# Altium schematic sheet Fan_Config_UART_OptionalHeader.SchDoc
size A3; SheetNumber: 15; SheetTotal: 19
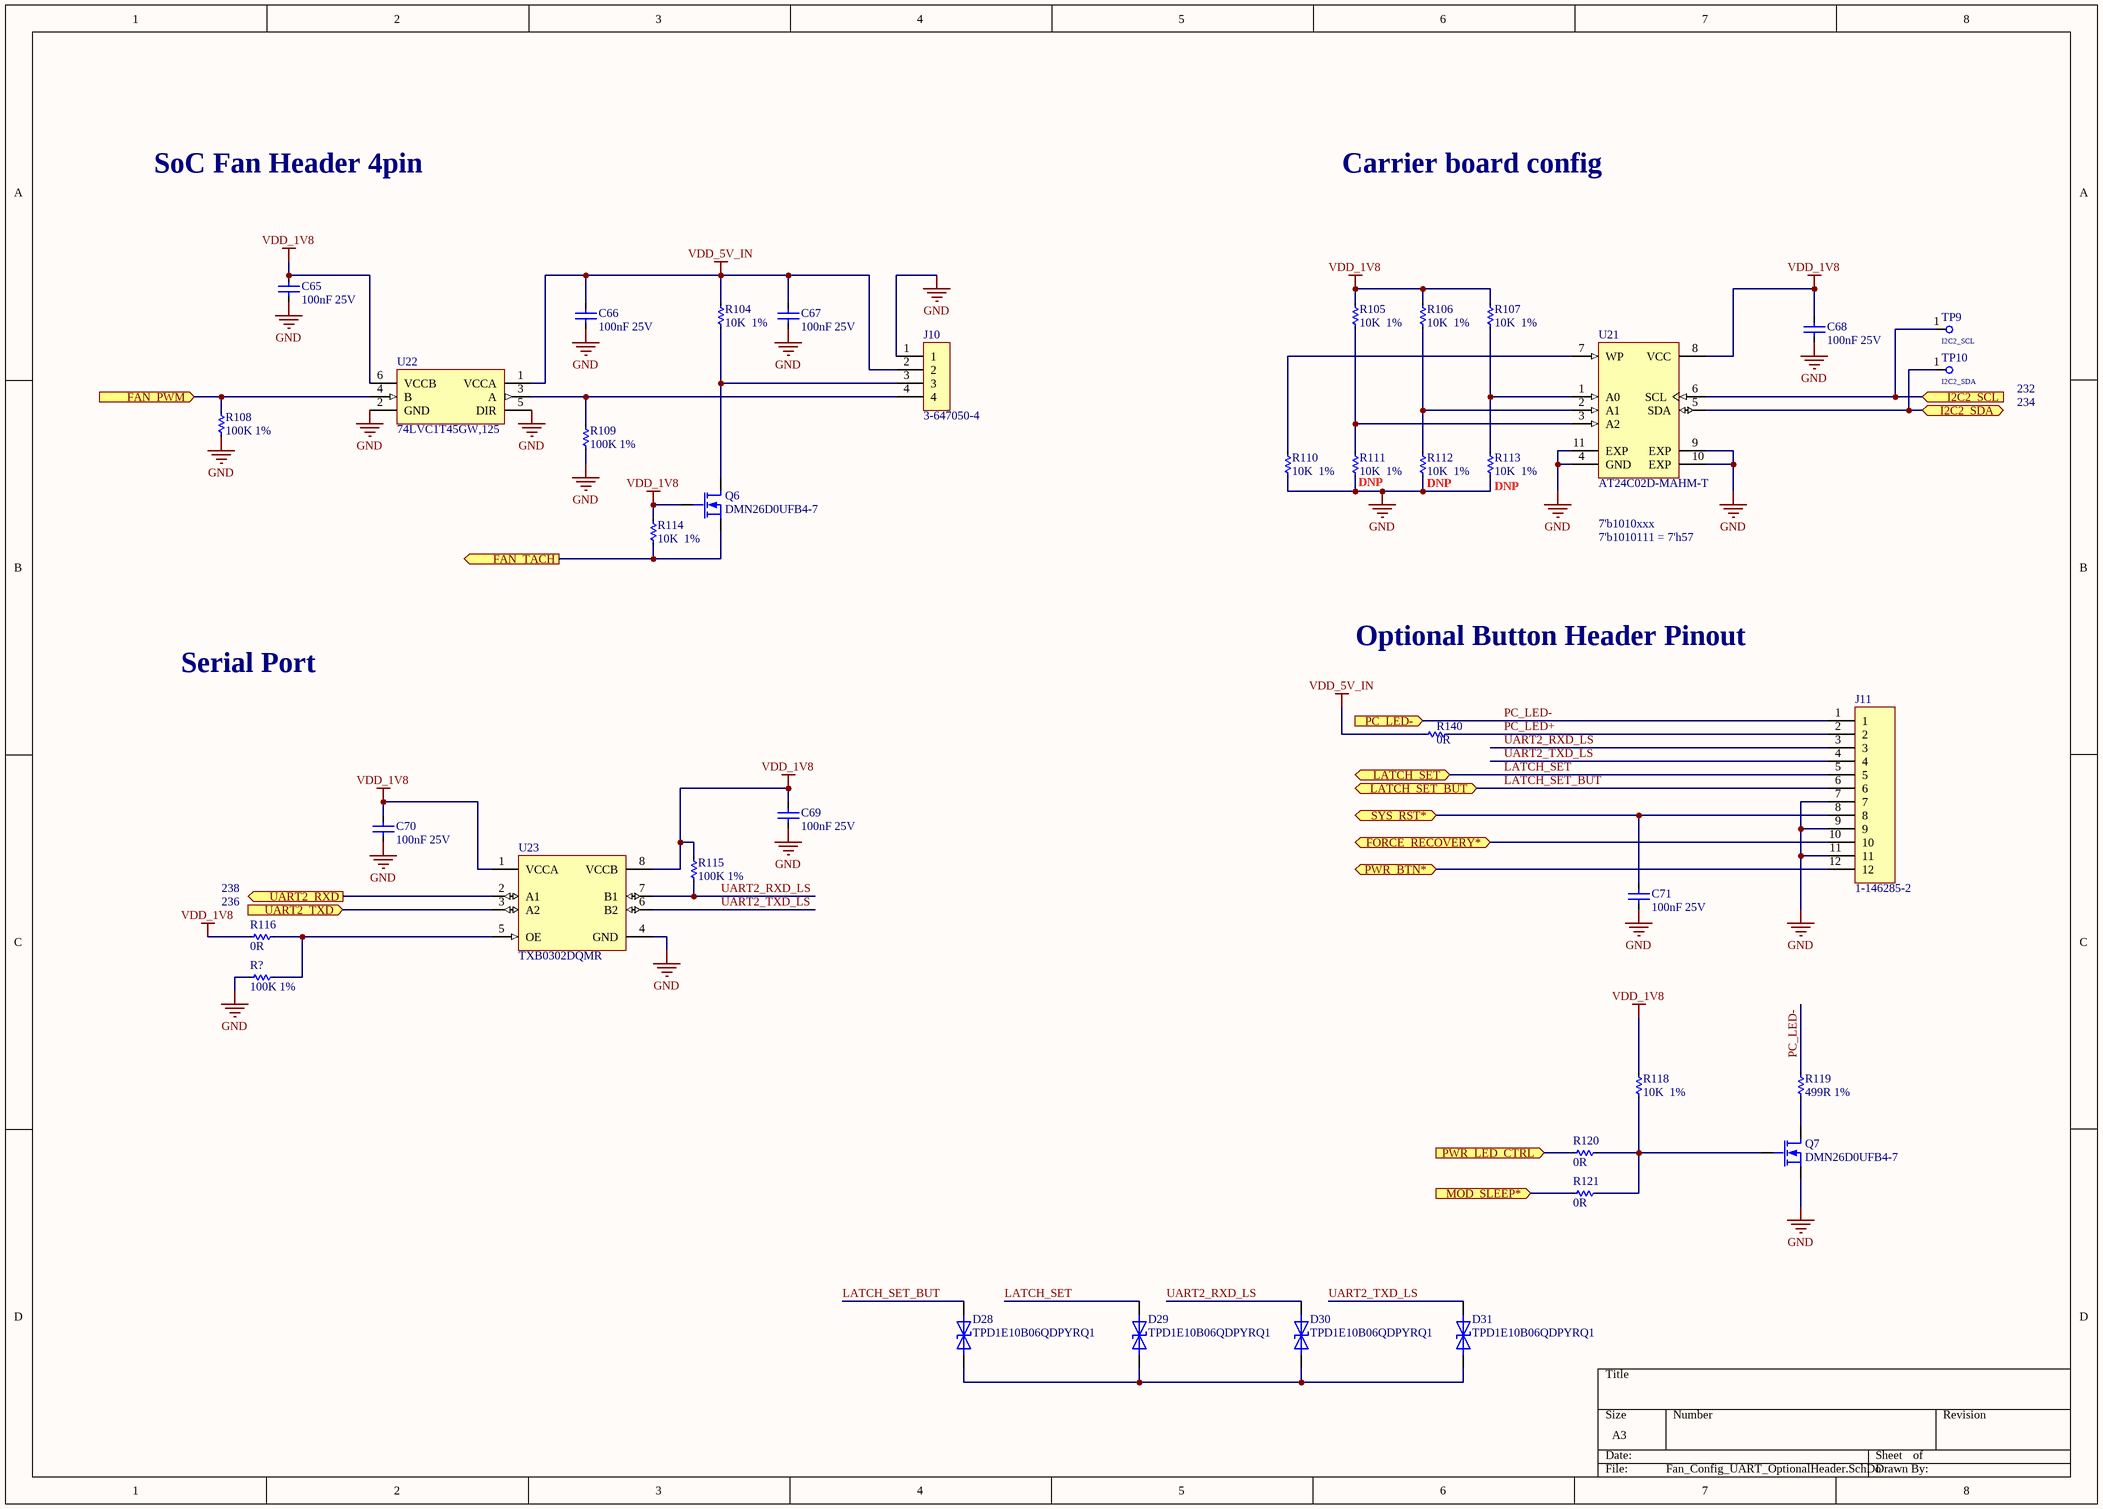
[diagram p0: Fan_Config_UART_OptionalHeader.SchDoc]

## Parts
C65  100nF 25V  [C0402]
C66  100nF 25V  [C0402]
C67  100nF 25V  [C0402]
C68  100nF 25V  [C0402]
C69  100nF 25V  [C0402]
C70  100nF 25V  [C0402]
C71  100nF 25V  [C0402]
D28  TPD1E10B06QDPYRQ1  [2-X1SON (1x.60)]
D29  TPD1E10B06QDPYRQ1  [2-X1SON (1x.60)]
D30  TPD1E10B06QDPYRQ1  [2-X1SON (1x.60)]
D31  TPD1E10B06QDPYRQ1  [2-X1SON (1x.60)]
J10  3-647050-4  [3-647050-4]
J11  1-146285-2
Q6  DMN26D0UFB4-7  [DFN1006-3]
Q7  DMN26D0UFB4-7  [DFN1006-3]
R104  10K  1%  [R0402]
R105  10K  1%  [R0402]
R106  10K  1%  [R0402]
R107  10K  1%  [R0402]
R108  100K 1%  [R0402]
R109  100K 1%  [R0402]
R110  10K  1%  [R0402]
R111  10K  1%  [R0402]
R112  10K  1%  [R0402]
R113  10K  1%  [R0402]
R114  10K  1%  [R0402]
R115  100K 1%  [R0402]
R116  0R  [R0402]
R118  10K  1%  [R0402]
R119  499R 1%  [R0402]
R120  0R  [R0402]
R121  0R  [R0402]
R140  0R  [R0603]
R?  100K 1%  [R0402]
TP9  I2C2_SCL  [TestPoint_Pad_D1.0mm]
TP10  I2C2_SDA  [TestPoint_Pad_D1.0mm]
U21  AT24C02D-MAHM-T  [UDFN (2x3)-8]
U22  74LVC1T45GW,125  [SOT-363]
U23  TXB0302DQMR  [8-X2SON (1.8x1.2)]

## Ports
FAN_PWM (in), FAN_TACH (out), FORCE_RECOVERY* (bidir), I2C2_SCL (in), I2C2_SDA (bidir), LATCH_SET (bidir), LATCH_SET_BUT (bidir), MOD_SLEEP* (in), PC_LED- (in), PWR_BTN* (bidir), PWR_LED_CTRL (in), SYS_RST* (bidir), UART2_RXD (out), UART2_TXD (in)

## Nets
GND: C65.1 C66.1 C67.1 C68.1 C69.1 C70.1 C71.1 J10.1 J11.7 J11.9 J11.11 Q7.2(S) R108.1 R109.1 R110.1 R111.1 R112.1 R113.1 R?.1 U21.4(GND) U21.9(EXP) U21.10(EXP) U21.11(EXP) U22.2(GND) U22.5(DIR) U23.4(GND)
VDD_1V8: C65.2 C68.2 C69.2 C70.2 Q6.1(G) R105.2 R106.2 R107.2 R114.2 R115.2 R116.1 R118.2 U21.8(VCC) U22.6(VCCB) U23.1(VCCA) U23.8(VCCB)
VDD_5V_IN: C66.2 C67.2 J10.2 R104.2 R140.1 U22.1(VCCA)
FAN_PWM: R108.2 U22.4(B) ; port FAN_PWM
FAN_TACH: Q6.2(S) R114.1 ; port FAN_TACH
FORCE_RECOVERY*: J11.10 ; port FORCE_RECOVERY*
I2C2_SCL: TP9.1 U21.6(SCL) ; port I2C2_SCL
I2C2_SDA: TP10.1 U21.5(SDA) ; port I2C2_SDA
LATCH_SET: D29.2 J11.5 ; port LATCH_SET
LATCH_SET_BUT: D28.2 J11.6 ; port LATCH_SET_BUT
MOD_SLEEP*: R121.1 ; port MOD_SLEEP*
PC_LED+: J11.2 R140.2
PC_LED-: J11.1 R119.2 ; port PC_LED-
PWR_BTN*: J11.12 ; port PWR_BTN*
PWR_LED_CTRL: R120.1 ; port PWR_LED_CTRL
SYS_RST*: C71.2 J11.8 ; port SYS_RST*
UART2_RXD: U23.2(A1) ; port UART2_RXD
UART2_RXD_LS: D30.2 J11.3 R115.1 U23.7(B1)
UART2_TXD: U23.3(A2) ; port UART2_TXD
UART2_TXD_LS: D31.2 J11.4 U23.6(B2)
NetD28_1: D28.1 D29.1 D30.1 D31.1
NetJ10_3: J10.3 Q6.3(D) R104.1
NetJ10_4: J10.4 R109.2 U22.3(A)
NetQ7_1: Q7.1(G) R118.1 R120.2 R121.2
NetQ7_3: Q7.3(D) R119.1
NetR105_1: R105.1 R111.2 U21.3(A2)
NetR106_1: R106.1 R112.2 U21.2(A1)
NetR107_1: R107.1 R113.2 U21.1(A0)
NetR110_2: R110.2 U21.7(WP)
NetR116_2: R116.2 R?.2 U23.5(OE)

## Notes on the sheet
- SoC Fan Header 4pin
- Carrier board config
- 232
- 234
- (near R111) DNP
- (near R112) DNP
- (near R113) DNP
- 7'b1010xxx
- 7'b1010111 = 7'h57
- Optional Button Header Pinout
- Serial Port
- (near R116) 238
- (near R116) 236

## Library data of the parts
C65-C71 = TMK105BJ104KV-F: CAP CER 0.1UF 25V X5R 0402 / High Value Multilayer Ceramic Capacitors (High dielectric type); Manufacturer: Taiyo Yuden; Tolerance: 10%; Supplier 1: Digi-Key; Manufacturer Part Number: TMK105BJ104KV-F; RoHS: Yes; Category: Ceramic Capacitors; Stock 1: 11997960; Pricing 1: 1=0.10000, 10=0.03700, 50=0.02000, 100=0.01630, 500=0.01166, 1000=0.00917, 2500=0.00833, 5000=0.00767 (USD); Mount: Surface Mount; Case/Package: 0402; Number of Pins: 2; Case Code (Imperial): 0402; Case Code (Metric): 1005; Weight: 2.3E-05oz; Min Operating Temperature: -55°C; Max Operating Temperature: 85°C; Capacitance: 100nF; Packaging: Tape and Reel; Dielectric: X5R; Voltage Rating (DC): 25V; Voltage Rating: 25V; Package Quantity: 1; Termination: SMD/SMT; Resistor Type: Ceramic; Voltage: 25V; Series: M; Construction: Flat; Length: 1mm; Width: 0.02inch; Height: 0.5mm; Depth: 0.5mm; Thickness: 0.022inch; Reach SVHC Compliant: Yes; Lead Free: Lead Free; Halogen Free: Halogen Free; RoHS Compliant: Yes; Supplier Part Number 1: 587-1456-1-ND
D28-D31 = TPD1E10B06QDPYRQ1: Automotive 12-pF, ±5.5V ±30-kV ESD protection diode in 0402 Package 2-X1SON -40 to 125; Manufacturer: Texas Instruments; Capacitance: 12pF; Number of Channels: 1; Supplier 1: Mouser; Manufacturer Part Number: TPD1E10B06QDPYRQ1; RoHS: Yes; Category: TVS Diodes; Stock 1: 130973; Pricing 1: 1=0.46000, 10=0.34900, 50=0.34900, 100=0.21800, 1000=0.11500, 10000=0.08800 (USD); Case/Package: 0402; Number of Pins: 2; Min Operating Temperature: -40°C; Max Operating Temperature: 125°C; Lead Free: Lead Free; RoHS Compliant: Yes; ComponentLink1URL: http://www.ti.com/lit/ds/symlink/tpd1e10b06-q1.pdf?src-supplier=Digi-Key; ComponentLink1Description: http://www.ti.com/lit/ds/symlink/tpd1e10b06-q1.pdf?src-supplier=Digi-Key; ComponentLink2URL: http://www.ti.com/general/docs/suppproductinfo.tsp?distId=10&amp;gotoUrl=http%3A%2F%2Fwww.ti.com%2Flit%2Fgpn%2Ftpd1e10b06-q1&src-supplier=Digi-Key; ComponentLink2Description: http://www.ti.com/general/docs/suppproductinfo.tsp?distId=10&amp;gotoUrl=http%3A%2F%2Fwww.ti.com%2Flit%2Fgpn%2Ftpd1e10b06-q1&src-supplier=Digi-Key; Supplier Part Number 1: 595-PD1E10B06QDPYRQ1
J10 = 3-647050-4: Header Assembly 4 Position MTA100 F/L HITEMP MTA-100 Series; Manufacturer: TE Connectivity; Supplier 1: Digi-Key; Manufacturer Part Number: 3-647050-4; RoHS: Yes; Category: Uncategorized; Stock 1: 12221; Pricing 1: 1=2.60000, 10=2.26400, 100=2.02290, 500=1.68574, 1000=1.44492, 5000=1.28116 (USD); ComponentLink1URL: https://datasheet.ciiva.com/717/eng-cd-647050-t-647050-c-drw-717307.pdf?src-supplier=Digi-Key; ComponentLink1Description: https://datasheet.ciiva.com/717/eng-cd-647050-t-647050-c-drw-717307.pdf?src-supplier=Digi-Key; ComponentLink2URL: https://datasheet.ciiva.com/30190/8852eng-ds-82056-mta-0608-30190425.pdf?src-supplier=Onlinecomponents.com; ComponentLink2Description: https://datasheet.ciiva.com/30190/8852eng-ds-82056-mta-0608-30190425.pdf?src-supplier=Onlinecomponents.com; Supplier Part Number 1: A122444-ND
J11 = 1-146285-2: Conn Unshrouded Header HDR 12 POS 2.54mm Solder ST Thru-Hole Automotive Carton; Manufacturer: TE Connectivity; Supplier 1: Avnet; Manufacturer Part Number: 1-146285-2; RoHS: No; Category: Connectors; ComponentLink1URL: https://datasheet.ciiva.com/9518/eng-ds-1307819-ampmodu-0811-9518222.pdf?src-supplier=Avnet; ComponentLink1Description: https://datasheet.ciiva.com/9518/eng-ds-1307819-ampmodu-0811-9518222.pdf?src-supplier=Avnet; ComponentLink2URL: https://datasheet.ciiva.com/716/eng-cd-146285-h-716787.pdf?src-supplier=Digi-Key; ComponentLink2Description: https://datasheet.ciiva.com/716/eng-cd-146285-h-716787.pdf?src-supplier=Digi-Key; Supplier Part Number 1: 1-146285-2
Q6 Q7 = DMN26D0UFB4-7: Single N-Channel 20 V 350 mW Silicon Surface Mount Mosfet - DFN-3; Manufacturer: Diodes; Rise Time: 7.9ns; Rds On Max: 3R; Input Capacitance: 14.1pF; Continuous Drain Current (ID): 240mA; Drain to Source Resistance: 1.8R; Power Dissipation: 350mW; Turn-Off Delay Time: 13.4ns; Drain to Source Voltage (Vdss): 20V; Turn-On Delay Time: 3.8ns; Fall Time: 15.2ns; Number of Elements: 1; Gate to Source Voltage (Vgs): 10V; On-State Resistance: 10R; FET Type: 1 N-Channel; Supplier 1: Mouser; Manufacturer Part Number: DMN26D0UFB4-7; RoHS: Yes; Category: MOSFETs; Stock 1: 21043; Pricing 1: 1=0.38000, 10=0.32100, 50=0.32100, 100=0.17000, 1000=0.07700, 10000=0.05000 (USD); Mount: Surface Mount; Case/Package: DFN; Number of Pins: 3; Min Operating Temperature: -55°C; Max Operating Temperature: 150°C; Packaging: Tape and Reel; Package Quantity: 3000; Max Power Dissipation: 350mW; Element Configuration: Single; Number of Channels: 1; Polarity: N-CHANNEL; Series: -; Drain-source On Resistance-Max: 10R; Length: 1.05mm; Width: 0.65mm; Height: 0.35mm; Radiation Hardening: No; Reach SVHC Compliant: Yes; Lead Free: Lead Free; RoHS Compliant: Yes; ComponentLink1URL: https://datasheet.ciiva.com/4443/ds31775-89139-4443083.pdf?src-supplier=Mouser; ComponentLink1Description: https://datasheet.ciiva.com/4443/ds31775-89139-4443083.pdf?src-supplier=Mouser; ComponentLink2URL: https://datasheet.ciiva.com/11176/ds31775-11176556.pdf?src-supplier=Avnet; ComponentLink2Description: https://datasheet.ciiva.com/11176/ds31775-11176556.pdf?src-supplier=Avnet; ComponentLink3URL: https://datasheet.ciiva.com/16434/ds31775-16434037.pdf?src-supplier=Future+Electronics; ComponentLink3Description: https://datasheet.ciiva.com/16434/ds31775-16434037.pdf?src-supplier=Future+Electronics; ComponentLink4URL: https://datasheet.ciiva.com/48532/ds31775-48532486.pdf?src-supplier=Avnet; ComponentLink4Description: https://datasheet.ciiva.com/48532/ds31775-48532486.pdf?src-supplier=Avnet; ComponentLink5URL: https://datasheet.ciiva.com/934/ds31775-934573.pdf?src-supplier=Digi-Key; ComponentLink5Description: https://datasheet.ciiva.com/934/ds31775-934573.pdf?src-supplier=Digi-Key; ComponentLink6URL: https://datasheet.ciiva.com/934/ds31775-934574.pdf?src-supplier=Digi-Key; ComponentLink6Description: https://datasheet.ciiva.com/934/ds31775-934574.pdf?src-supplier=Digi-Key; ComponentLink7URL: https://datasheet.ciiva.com/934/ds31775-934572.pdf?src-supplier=Digi-Key; ComponentLink7Description: https://datasheet.ciiva.com/934/ds31775-934572.pdf?src-supplier=Digi-Key; Supplier Part Number 1: 621-DMN26D0UFB4-7
R104-R107 R110-R114 R118 = RC0402FR-0710KP: Res General Purpose Thick Film 0402 10K Ohm 1% 1/16W ±100ppm/°C Molded SMD Paper T/R; Manufacturer: Yageo; Resistance: 10kR; Max Power Dissipation: 63mW; Temperature Coefficient: 150ppm/°C; Supplier 1: Digi-Key; Manufacturer Part Number: RC0402FR-0710KP; RoHS: Yes; Category: Chip SMD Resistors; Stock 1: 1032587; Pricing 1: 1=0.10000, 10=0.03100, 100=0.01280, 1000=0.00573, 2500=0.00497, 5000=0.00411 (USD); Case/Package: 0402; Case Code (Metric): 1005; Case Code (Imperial): 0402; Min Operating Temperature: -55°C; Max Operating Temperature: 155°C; Packaging: Tape and Reel; Resistor Type: Thick Film; Number of Terminations: 2; Tolerance: 1%; Features: Moisture Resistant; Length: 0.039inch; Width: 0.02inch; Height: 0.016inch; RoHS Compliant: Yes; ComponentLink1URL: http://www.yageo.com/NewPortal/yageodocoutput?fileName=/pdf/R-Chip/PYu-RC_51_RoHS_P_0.pdf&src-supplier=Digi-Key; ComponentLink1Description: http://www.yageo.com/NewPortal/yageodocoutput?fileName=/pdf/R-Chip/PYu-RC_51_RoHS_P_0.pdf&src-supplier=Digi-Key; Supplier Part Number 1: YAG1249CT-ND
R108 R109 R115 R? = RC0402FR-07100KL: RES SMD 100K OHM 1% 1/16W 0402; Manufacturer: Yageo; Power Rating: 63mW; Voltage Rating: 50V; Resistance: 100kR; Temperature Coefficient: 100ppm/°C; Supplier 1: Digi-Key; Manufacturer Part Number: RC0402FR-07100KL; RoHS: Yes; Category: Chip SMD Resistors; Stock 1: 41082272; Pricing 1: 1=0.10000, 10=0.01400, 100=0.00580, 1000=0.00262, 2500=0.00228, 5000=0.00188 (USD); Case/Package: 0402; Case Code (Metric): 1005; Case Code (Imperial): 0402; Min Operating Temperature: -55°C; Max Operating Temperature: 155°C; Tolerance: 1%; Package Quantity: 1; Packaging: Tape and Reel; Resistor Type: Thick Film; Number of Terminations: 2; Termination: SMD/SMT; Max Power Dissipation: 63mW; Working Voltage: 50V; Features: Moisture Resistant; Series: RC; Resistance Tolerance: 1%; Construction: Rectangular; Technology: THICK FILM; Length: 0.039inch; Width: 0.02inch; Height: 0.016inch; Depth: 0.5mm; Reach SVHC Compliant: Yes; Military Standard: Not; Lead Free: Lead Free; RoHS Compliant: Yes; ComponentLink1URL: https://datasheet.ciiva.com/11819/0900766b80c66297-11819452.pdf?src-supplier=RSComponents; ComponentLink1Description: https://datasheet.ciiva.com/11819/0900766b80c66297-11819452.pdf?src-supplier=RSComponents; ComponentLink2URL: https://datasheet.ciiva.com/22747/1018594-22747509.pdf?src-supplier=Element14; ComponentLink2Description: https://datasheet.ciiva.com/22747/1018594-22747509.pdf?src-supplier=Element14; ComponentLink3URL: https://datasheet.ciiva.com/2453/pyu-r-int-thick-7-2453362.pdf?src-supplier=Digi-Key; ComponentLink3Description: https://datasheet.ciiva.com/2453/pyu-r-int-thick-7-2453362.pdf?src-supplier=Digi-Key; ComponentLink4URL: https://datasheet.ciiva.com/2453/pyu-r-int-thick-7-2453363.pdf?src-supplier=Digi-Key; ComponentLink4Description: https://datasheet.ciiva.com/2453/pyu-r-int-thick-7-2453363.pdf?src-supplier=Digi-Key; ComponentLink5URL: https://datasheet.ciiva.com/2453/pyu-r-int-thick-7-2453361.pdf?src-supplier=Digi-Key; ComponentLink5Description: https://datasheet.ciiva.com/2453/pyu-r-int-thick-7-2453361.pdf?src-supplier=Digi-Key; ComponentLink6URL: https://datasheet.ciiva.com/12667/pyu-rc0402-51-rohs-l-6-r-12667930.pdf?src-supplier=Mouser; ComponentLink6Description: https://datasheet.ciiva.com/12667/pyu-rc0402-51-rohs-l-6-r-12667930.pdf?src-supplier=Mouser; ComponentLink7URL: https://datasheet.ciiva.com/15189/getdatasheetpartid-323696-15189334.pdf?src-supplier=Verical; ComponentLink7Description: https://datasheet.ciiva.com/15189/getdatasheetpartid-323696-15189334.pdf?src-supplier=Verical; Supplier Part Number 1: 311-100KLRCT-ND
R116 R120 R121 = RC0402FR-070RL: RC Series 0402 0.063 W 0 Ohm Jumper Surface Mount Thick Film Chip Resistor; Manufacturer: Yageo; Tolerance: 1%; Power Rating: 62.5mW; Voltage Rating: 50V; Temperature Coefficient: 200ppm/°C; Max Power Dissipation: 63mW; Supplier 1: Digi-Key; Manufacturer Part Number: RC0402FR-070RL; RoHS: Yes; Category: Chip SMD Resistors; Stock 1: 8989202; Pricing 1: 1=0.10000, 10=0.01200, 25=0.00840, 50=0.00640, 100=0.00480, 250=0.00364, 500=0.00290, 1000=0.00214, 5000=0.00154 (USD); Mount: Surface Mount; Case/Package: 0402; Case Code (Imperial): 0402; Case Code (Metric): 1005; Contact Plating: Tin,Matte; Size Code: 0402; Min Operating Temperature: -55°C; Max Operating Temperature: 155°C; Resistance: 0R; Packaging: Tape and Reel; Resistor Type: Thick Film; Termination: SMD/SMT; Features: Moisture Resistant; Series: RC; Number of Terminations: 2; Length: 1mm; Width: 0.5mm; Height: 0.35mm; Radiation Hardening: No; Lead Free: Lead Free; RoHS Compliant: Yes; ComponentLink1URL: https://datasheet.ciiva.com/8896/pyu-rc0402-51-rohs-l-6-8896149.pdf?src-supplier=Avnet; ComponentLink1Description: https://datasheet.ciiva.com/8896/pyu-rc0402-51-rohs-l-6-8896149.pdf?src-supplier=Avnet; ComponentLink2URL: https://datasheet.ciiva.com/16790/pyu-rc0402-51-rohs-l-6-r-16790444.pdf?src-supplier=Future+Electronics; ComponentLink2Description: https://datasheet.ciiva.com/16790/pyu-rc0402-51-rohs-l-6-r-16790444.pdf?src-supplier=Future+Electronics; Supplier Part Number 1: 311-0.0LRCT-ND
R119 = RC0402FR-07499RL: Res General Purpose Thick Film 0402 499 Ohm 1% 1/16W ±100ppm/°C Molded SMD Paper T/R; Manufacturer: Yageo; Voltage Rating (DC): 50V; Power Rating: 62.5mW; Max Power Dissipation: 63mW; Supplier 1: Digi-Key; Manufacturer Part Number: RC0402FR-07499RL; RoHS: Yes; Category: Chip SMD Resistors; Stock 1: 3766935; Pricing 1: 1=0.10000, 10=0.01400, 100=0.00580, 1000=0.00262, 2500=0.00228, 5000=0.00188 (USD); Case/Package: 0402; Case Code (Metric): 1005; Case Code (Imperial): 0402; Size Code: 0402; Min Operating Temperature: -55°C; Max Operating Temperature: 155°C; Tolerance: 1%; Package Quantity: 1; Packaging: Tape and Reel; Features: Moisture Resistant; Resistance: 499R; Voltage Rating: 50V; Resistor Type: Thick Film; Number of Terminations: 2; Termination: SMD/SMT; Temperature Coefficient: 100ppm/°C; Series: RC; Resistance Tolerance: 1%; Construction: Rectangular; Length: 0.039inch; Width: 0.02inch; Height: 0.016inch; Depth: 0.5mm; Lead Free: Lead Free; Reach SVHC Compliant: Yes; Military Standard: Not; RoHS Compliant: Yes; ComponentLink1URL: https://datasheet.ciiva.com/2453/pyu-r-int-thick-7-2453539.pdf?src-supplier=Digi-Key; ComponentLink1Description: https://datasheet.ciiva.com/2453/pyu-r-int-thick-7-2453539.pdf?src-supplier=Digi-Key; ComponentLink2URL: https://datasheet.ciiva.com/2453/pyu-r-int-thick-7-2453540.pdf?src-supplier=Digi-Key; ComponentLink2Description: https://datasheet.ciiva.com/2453/pyu-r-int-thick-7-2453540.pdf?src-supplier=Digi-Key; ComponentLink3URL: https://datasheet.ciiva.com/2453/pyu-r-int-thick-7-2453538.pdf?src-supplier=Digi-Key; ComponentLink3Description: https://datasheet.ciiva.com/2453/pyu-r-int-thick-7-2453538.pdf?src-supplier=Digi-Key; Supplier Part Number 1: 311-499LRCT-ND
R140 = CR0603-J/-000ELF: RES SMD 0 OHM JUMPER 1/10W 0603; Manufacturer: Bourns; Resistance: 0mR; Power Rating: 100mW; Tolerance: 1%; Voltage Rating: 50V; Temperature Coefficient: 500ppm/°C; Resistance Tolerance: 5%; Supplier 1: Digi-Key; Manufacturer Part Number: CR0603-J/-000ELF; RoHS: Yes; Category: Chip SMD Resistors; Stock 1: 1690954; Pricing 1: 1=0.10000, 10=0.01300, 25=0.00960, 50=0.00720, 100=0.00540, 250=0.00408, 500=0.00328, 1000=0.00241 (USD); Mount: Surface Mount; Case/Package: 0603; Number of Pins: 2; Case Code (Imperial): 0603; Case Code (Metric): 1608; Contact Plating: Tin; Min Operating Temperature: -55°C; Max Operating Temperature: 155°C; Packaging: Tape and Reel; Package Quantity: 5000; Resistor Type: Thick Film; Termination: SMD/SMT; Max Power Dissipation: 100mW; Voltage Rating (DC): 50V; Series: CR0603; Technology: THICK FILM; Construction: Rectangular; Features: Moisture Resistant; Number of Terminations: 2; Length: 1.6mm; Width: 0.8mm; Height: 0.45mm; Depth: 0.8mm; Thickness: 457um; Radiation Hardening: No; Reach SVHC Compliant: Yes; Military Standard: Not; RoHS Compliant: Yes; ComponentLink1URL: https://datasheet.ciiva.com/11809/0900766b80fcdb72-11809586.pdf?src-supplier=RSComponents; ComponentLink1Description: https://datasheet.ciiva.com/11809/0900766b80fcdb72-11809586.pdf?src-supplier=RSComponents; ComponentLink2URL: https://datasheet.ciiva.com/7001/1902866-7001645.pdf?src-supplier=Newark; ComponentLink2Description: https://datasheet.ciiva.com/7001/1902866-7001645.pdf?src-supplier=Newark; ComponentLink3URL: https://datasheet.ciiva.com/7986/691949-7986171.pdf?src-supplier=Element14; ComponentLink3Description: https://datasheet.ciiva.com/7986/691949-7986171.pdf?src-supplier=Element14; ComponentLink4URL: https://datasheet.ciiva.com/7660/1856384-7660956.pdf?src-supplier=Element14; ComponentLink4Description: https://datasheet.ciiva.com/7660/1856384-7660956.pdf?src-supplier=Element14; ComponentLink5URL: https://datasheet.ciiva.com/22693/1902866-22693213.pdf?src-supplier=Element14; ComponentLink5Description: https://datasheet.ciiva.com/22693/1902866-22693213.pdf?src-supplier=Element14; ComponentLink6URL: https://datasheet.ciiva.com/5545/chpreztr-5545708.pdf?src-supplier=Mouser; ComponentLink6Description: https://datasheet.ciiva.com/5545/chpreztr-5545708.pdf?src-supplier=Mouser; ComponentLink7URL: https://datasheet.ciiva.com/16761/70154685-16761515.pdf?src-supplier=Allied+Electronics; ComponentLink7Description: https://datasheet.ciiva.com/16761/70154685-16761515.pdf?src-supplier=Allied+Electronics; ComponentLink8URL: https://datasheet.ciiva.com/30062/159chpreztr-30062601.pdf?src-supplier=Onlinecomponents.com; ComponentLink8Description: https://datasheet.ciiva.com/30062/159chpreztr-30062601.pdf?src-supplier=Onlinecomponents.com; ComponentLink9URL: https://datasheet.ciiva.com/48692/001055497-da-01-en-smd-wid-cr0603-j-000elf-0-0-ohm-1-10w-48692135.pdf?src-supplier=Conrad; ComponentLink9Description: https://datasheet.ciiva.com/48692/001055497-da-01-en-smd-wid-cr0603-j-000elf-0-0-ohm-1-10w-48692135.pdf?src-supplier=Conrad; Supplier Part Number 1: CR0603-J/-000ELFCT-ND
TP9 TP10 = TestPoint_D1mm
U21 = AT24C02D-MAHM-T: EEPROM Serial-2Wire 2K-bit 256 x 8 1.8V/2.5V/3.3V 8-Pin UDFN EP T/R; Manufacturer: Microchip; Interface: I2C,Serial,2-Wire; Access Time: 900ns; Density: 2Kb; Frequency: 1MHz; Max Supply Voltage: 3.6V; Min Supply Voltage: 1.7V; Supplier 1: Mouser; Manufacturer Part Number: AT24C02D-MAHM-T; RoHS: Yes; Category: Uncategorized; Pricing 1: 1=0.28000, 10=0.28000, 50=0.28000, 100=0.28000, 1000=0.28000, 10000=0.28000 (USD); Mount: Surface Mount; Number of Pins: 8; Contact Plating: Gold; Min Operating Temperature: -40°C; Max Operating Temperature: 85°C; Package Quantity: 5000; Packaging: Tape and Reel; Memory Type: EEPROM; Max Frequency: 1MHz; RoHS Compliant: Yes; ComponentLink1URL: https://datasheet.ciiva.com/48496/atmel-8871-seeprom-at24c01d-02d-datasheet-48496454.pdf?src-supplier=Avnet; ComponentLink1Description: https://datasheet.ciiva.com/48496/atmel-8871-seeprom-at24c01d-02d-datasheet-48496454.pdf?src-supplier=Avnet; Supplier Part Number 1: 556-AT24C02D-MAHM-T
U22 = 74LVC1T45GW,125: TXRX XLATING DUAL 3ST 6TSSOP; Manufacturer: Nexperia; Supplier 1: Mouser; Manufacturer Part Number: 74LVC1T45GW,125; RoHS: Yes; Category: Voltage Level Shifters; Stock 1: 147483; Pricing 1: 1=0.47000, 10=0.37500, 50=0.37500, 100=0.27900, 1000=0.18200, 10000=0.15100 (USD); RoHS Compliant: Yes; ComponentLink1URL: http://www.farnell.com/datasheets/1645592.pdf?src-supplier=Farnell; ComponentLink1Description: http://www.farnell.com/datasheets/1645592.pdf?src-supplier=Farnell; ComponentLink2URL: https://assets.nexperia.com/documents/data-sheet/74LVC_LVCH1T45.pdf?src-supplier=Digi-Key; ComponentLink2Description: https://assets.nexperia.com/documents/data-sheet/74LVC_LVCH1T45.pdf?src-supplier=Digi-Key; Supplier Part Number 1: 771-74LVC1T45GW125
U23 = TXB0302DQMR: 2-BIT Bidirectional Voltage-level Translator 8-X2SON -40 to 85; Manufacturer: Texas Instruments; Data Rate: 100Mbps; Nominal Supply Current: 5uA; Number of Channels: 2; Propagation Delay: 5.8ns; Max Supply Voltage: 3.6V; Min Supply Voltage: 900mV; Number of Circuits: 1; High Level Output Current: -20uA; Low Level Output Current: 20uA; Quiescent Current: 10uA; Supplier 1: Digi-Key; Manufacturer Part Number: TXB0302DQMR; RoHS: Yes; Category: Voltage Level Shifters; Stock 1: 19543; Pricing 1: 1=0.81000, 10=0.71000, 25=0.66720, 100=0.54440, 250=0.50568, 500=0.43036, 1000=0.34429 (USD); Mount: Surface Mount; Number of Pins: 8; Contact Plating: Gold; Min Operating Temperature: -40°C; Max Operating Temperature: 85°C; Packaging: Tape and Reel; Package Quantity: 3000; Channel Type: Bidirectional; Logic Function: Translator; Number of Bits: 2; Number of Inputs: 2; Series: -; Supply Current: 5uA; Radiation Hardening: No; Reach SVHC Compliant: Yes; Lead Free: Lead Free; RoHS Compliant: Yes; ComponentLink1URL: https://datasheet.ciiva.com/3171/txb0302-3171542.pdf?src-supplier=Avnet; ComponentLink1Description: https://datasheet.ciiva.com/3171/txb0302-3171542.pdf?src-supplier=Avnet; ComponentLink2URL: https://datasheet.ciiva.com/15096/getdatasheetpartid-664533-15096459.pdf?src-supplier=Verical; ComponentLink2Description: https://datasheet.ciiva.com/15096/getdatasheetpartid-664533-15096459.pdf?src-supplier=Verical; ComponentLink3URL: https://datasheet.ciiva.com/29616/txb0302-29616007.pdf?src-supplier=Digi-Key; ComponentLink3Description: https://datasheet.ciiva.com/29616/txb0302-29616007.pdf?src-supplier=Digi-Key; ComponentLink4URL: https://datasheet.ciiva.com/29616/txb0302-29616006.pdf?src-supplier=Digi-Key; ComponentLink4Description: https://datasheet.ciiva.com/29616/txb0302-29616006.pdf?src-supplier=Digi-Key; ComponentLink5URL: https://datasheet.ciiva.com/29616/txb0302-29616008.pdf?src-supplier=Digi-Key; ComponentLink5Description: https://datasheet.ciiva.com/29616/txb0302-29616008.pdf?src-supplier=Digi-Key; Supplier Part Number 1: 296-36871-1-ND